# Altium schematic sheet BjtPhaseShiftOsc.SchDoc
size A; SheetNumber: 4; SheetTotal: 5
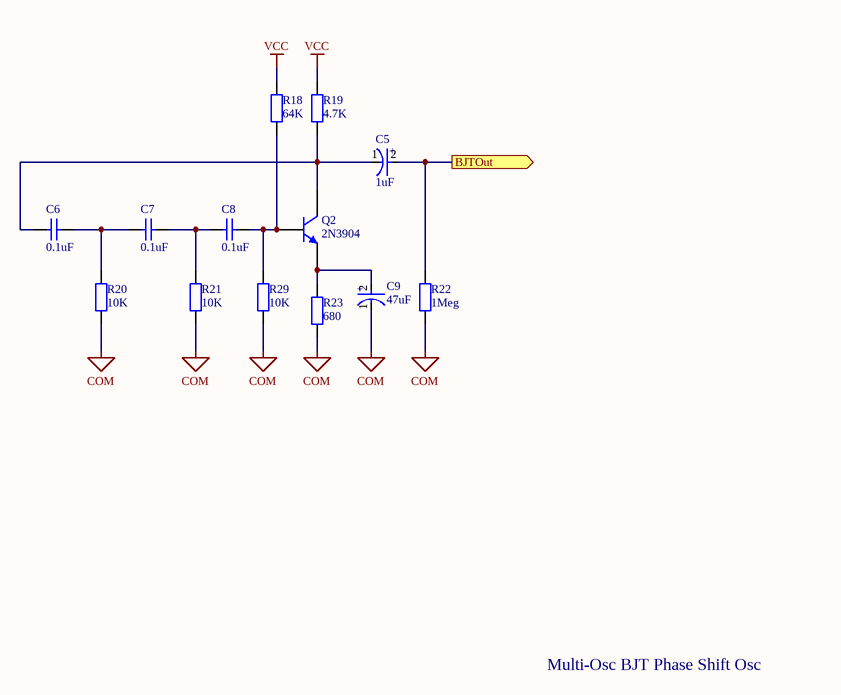
[diagram p0: BjtPhaseShiftOsc.SchDoc]

## Parts
C5  1uF  [FP-ESLE3-MFG]
C6  0.1uF  [KEMT-C315-THT-2]
C7  0.1uF  [KEMT-C315-THT-2]
C8  0.1uF  [KEMT-C315-THT-2]
C9  47uF  [FP-ESLE3-MFG]
Q2  2N3904  [TO-92A]
R18  64K  [AXIAL-0.4]
R19  4.7K  [AXIAL-0.4]
R20  10K  [AXIAL-0.4]
R21  10K  [AXIAL-0.4]
R22  1Meg  [AXIAL-0.4]
R23  680  [AXIAL-0.4]
R29  10K  [AXIAL-0.4]

## Ports
BJTOut (out)

## Nets
COM: C9.1(C) R20.2 R21.2 R22.2 R23.2 R29.2
VCC: R18.2 R19.1
BJTOut: C5.2(A) R22.1 ; port BJTOut
NetC5_1: C5.1(C) C6.2 Q2.3(C) R19.2
NetC6_1: C6.1 C7.2 R20.1
NetC7_1: C7.1 C8.1 R21.1
NetC8_2: C8.2 Q2.2(B) R18.1 R29.1
NetC9_2: C9.2(A) Q2.1(E) R23.1

## Notes on the sheet
- Multi-Osc BJT Phase Shift Osc
- (in symbol CMP-03015-000004-1) +

## Library data of the parts
C5 C9 = CMP-03015-000004-1: CAP ALUM 10UF 20% 100V THRU HOLE; Manufacturer Part Number: ESL106M100AE3AA; Manufacturer: kemet; Life: 10000Hours; Ripple Current: 280mA; Dissipation Factor: 9%; Esr: 0.68Ω; Leakage Current: 10uA; Material: Aluminum; Tolerance: 20%; Voltage Rating: 100V; Device Class L3: Aluminum Electrolytic Capacitors; Value: 10uF; Height: 12.5mm; Temperature Range High: +105°C; Capacitance: 10uF; ComponentLink2Description: Datasheet; Mouser Description: Cap, 10UF, 100V, Alu Elec, Radial; Category: Cap; Octopart: https://octopart.com/esl106m100ae3aa-kemet-84758885; Temperature: -40°C to +105°C; RoHS: TRUE; Device Class L1: Passive Components; Digikey Description: CAP ALUM 10UF 20% 100V THRU HOLE; ComponentLink2URL: https://content.kemet.com/datasheets/KEM_A4074_ESL.pdf; Device Class L2: Capacitors; Temperature Range Low: -40°C; Package: ESLE3; Automotive: No; Lead Free: Yes
C6-C8 = CMP-1664-00007-1: Capacitor, Ceramic, 0.01 uF, +/- 10%, 100 V, X7R, -55 to 125 degC, 2-Pin THD, RoHS, Bulk; Output Voltage: 70 V; Case\Package: PDIP; Forward Current: 60 mA; Nominal Vf: 1.3 V; Forward Voltage: 1.5 V; Channels: 2; Max Power Dissipation: 400 mW; Vce Max: 500 mV; ComponentLink1Description: Manufacturer URL; ComponentLink2Description: Datasheet; Packaging: Rail/Tube; RoHSCompliant: true; Package Quantity: 2000; PackageReference: C315-THT-2; Min Operating Temperature: -55 degC; Max Operating Temperature: 100 degC; Radiation Hardening: No; ComponentLink1URL: http://www.kemet.com/; DatasheetVersion: Aug-16; Pins: 16; PackageDescription: 2-Pin Through Hole Device, Body 3.81 x 2.54 mm; REACH SVHC: Unknown; Mount: Through Hole; ComponentLink2URL: http://capacitoredge.kemet.com/capedge2/DataSheet/Datasheet-C315C103K1R5TA.pdf?pn=C315C103K1R5TA{BULK}
Q2 = 2N3904: NPN General Purpose Amplifier; Published: 8-Jun-2000; LatestRevisionDate: 15-Jan-2003; LatestRevisionNote: PCB Footprint 'BCY-W3/D4.7' replaced; DatasheetVersion: 1997; PackageVersion: Sep-1998; PackageReference: TO-92A; Publisher: Altium Limited; PackageDescription: TO, Flat Index; 3 In-Line, Axial Leads; Body Dia. 4.5mm; Leads 0.51 x 0.48 mm (max); ComponentLink1Description: Manufacturer Link; ComponentLink1URL: http://www.fairchildsemi.com/; ComponentLink2Description: Datasheet; ComponentLink2URL: http://www.fairchildsemi.com/ds/2N%2F2N3904.pdf
R18 R20-R23 R29 = Res2: Resistor; Published: 8-Jun-2000; LatestRevisionDate: 17-Jul-2002; LatestRevisionNote: Re-released for DXP Platform.; PackageReference: AXIAL-0.4; Publisher: Altium Limited; PackageDescription: Axial Device, Thru-Hole; 2 Leads; 0.4 in Pin Spacing
  R18: Value: 64K
  R20 R21 R29: Value: 10K
  R22: Value: 1Meg
  R23: Value: 680
R19 = Res2: Resistor; Value: 1K; Published: 8-Jun-2000; LatestRevisionDate: 17-Jul-2002; LatestRevisionNote: Re-released for DXP Platform.; PackageReference: AXIAL-0.4; Publisher: Altium Limited; PackageDescription: Axial Device, Thru-Hole; 2 Leads; 0.4 in Pin Spacing